# Altium schematic sheet TestPointOfUnusedPCIe.SchDoc
size A3; SheetNumber: 10; SheetTotal: 11
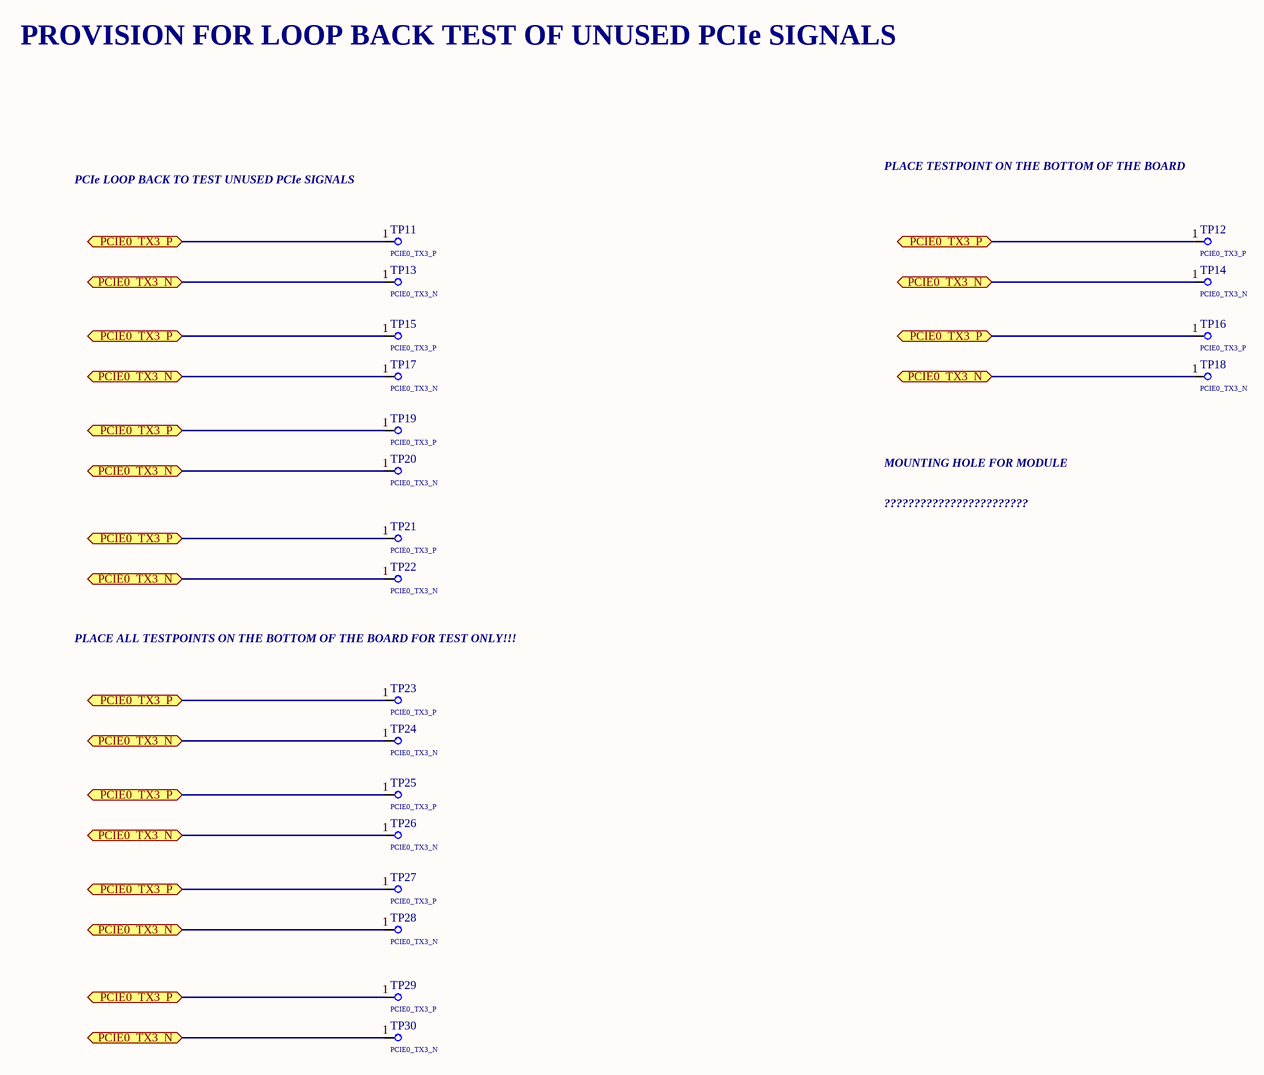
[diagram p0: TestPointOfUnusedPCIe.SchDoc]

## Parts
TP11  PCIE0_TX3_P  [TestPoint_Pad_D1.0mm]
TP12  PCIE0_TX3_P  [TestPoint_Pad_D1.0mm]
TP13  PCIE0_TX3_N  [TestPoint_Pad_D1.0mm]
TP14  PCIE0_TX3_N  [TestPoint_Pad_D1.0mm]
TP15  PCIE0_TX3_P  [TestPoint_Pad_D1.0mm]
TP16  PCIE0_TX3_P  [TestPoint_Pad_D1.0mm]
TP17  PCIE0_TX3_N  [TestPoint_Pad_D1.0mm]
TP18  PCIE0_TX3_N  [TestPoint_Pad_D1.0mm]
TP19  PCIE0_TX3_P  [TestPoint_Pad_D1.0mm]
TP20  PCIE0_TX3_N  [TestPoint_Pad_D1.0mm]
TP21  PCIE0_TX3_P  [TestPoint_Pad_D1.0mm]
TP22  PCIE0_TX3_N  [TestPoint_Pad_D1.0mm]
TP23  PCIE0_TX3_P  [TestPoint_Pad_D1.0mm]
TP24  PCIE0_TX3_N  [TestPoint_Pad_D1.0mm]
TP25  PCIE0_TX3_P  [TestPoint_Pad_D1.0mm]
TP26  PCIE0_TX3_N  [TestPoint_Pad_D1.0mm]
TP27  PCIE0_TX3_P  [TestPoint_Pad_D1.0mm]
TP28  PCIE0_TX3_N  [TestPoint_Pad_D1.0mm]
TP29  PCIE0_TX3_P  [TestPoint_Pad_D1.0mm]
TP30  PCIE0_TX3_N  [TestPoint_Pad_D1.0mm]

## Ports
PCIE0_TX3_N (bidir), PCIE0_TX3_P (bidir)

## Nets
PCIE0_TX3_N: TP13.1 TP14.1 TP17.1 TP18.1 TP20.1 TP22.1 TP24.1 TP26.1 TP28.1 TP30.1 ; port PCIE0_TX3_N
PCIE0_TX3_P: TP11.1 TP12.1 TP15.1 TP16.1 TP19.1 TP21.1 TP23.1 TP25.1 TP27.1 TP29.1 ; port PCIE0_TX3_P

## Notes on the sheet
- PROVISION FOR LOOP BACK TEST OF UNUSED PCIe SIGNALS
- PCIe LOOP BACK TO TEST UNUSED PCIe SIGNALS
- PLACE TESTPOINT ON THE BOTTOM OF THE BOARD
- MOUNTING HOLE FOR MODULE
- ????????????????????????
- PLACE ALL TESTPOINTS ON THE BOTTOM OF THE BOARD FOR TEST ONLY!!!

## Library data of the parts
TP11-TP30 = TestPoint_D1mm